# Altium schematic sheet Main.SchDoc: MoonPilot Power - Main
size A3; DrawnBy: Máni Magnússon; Revision: A
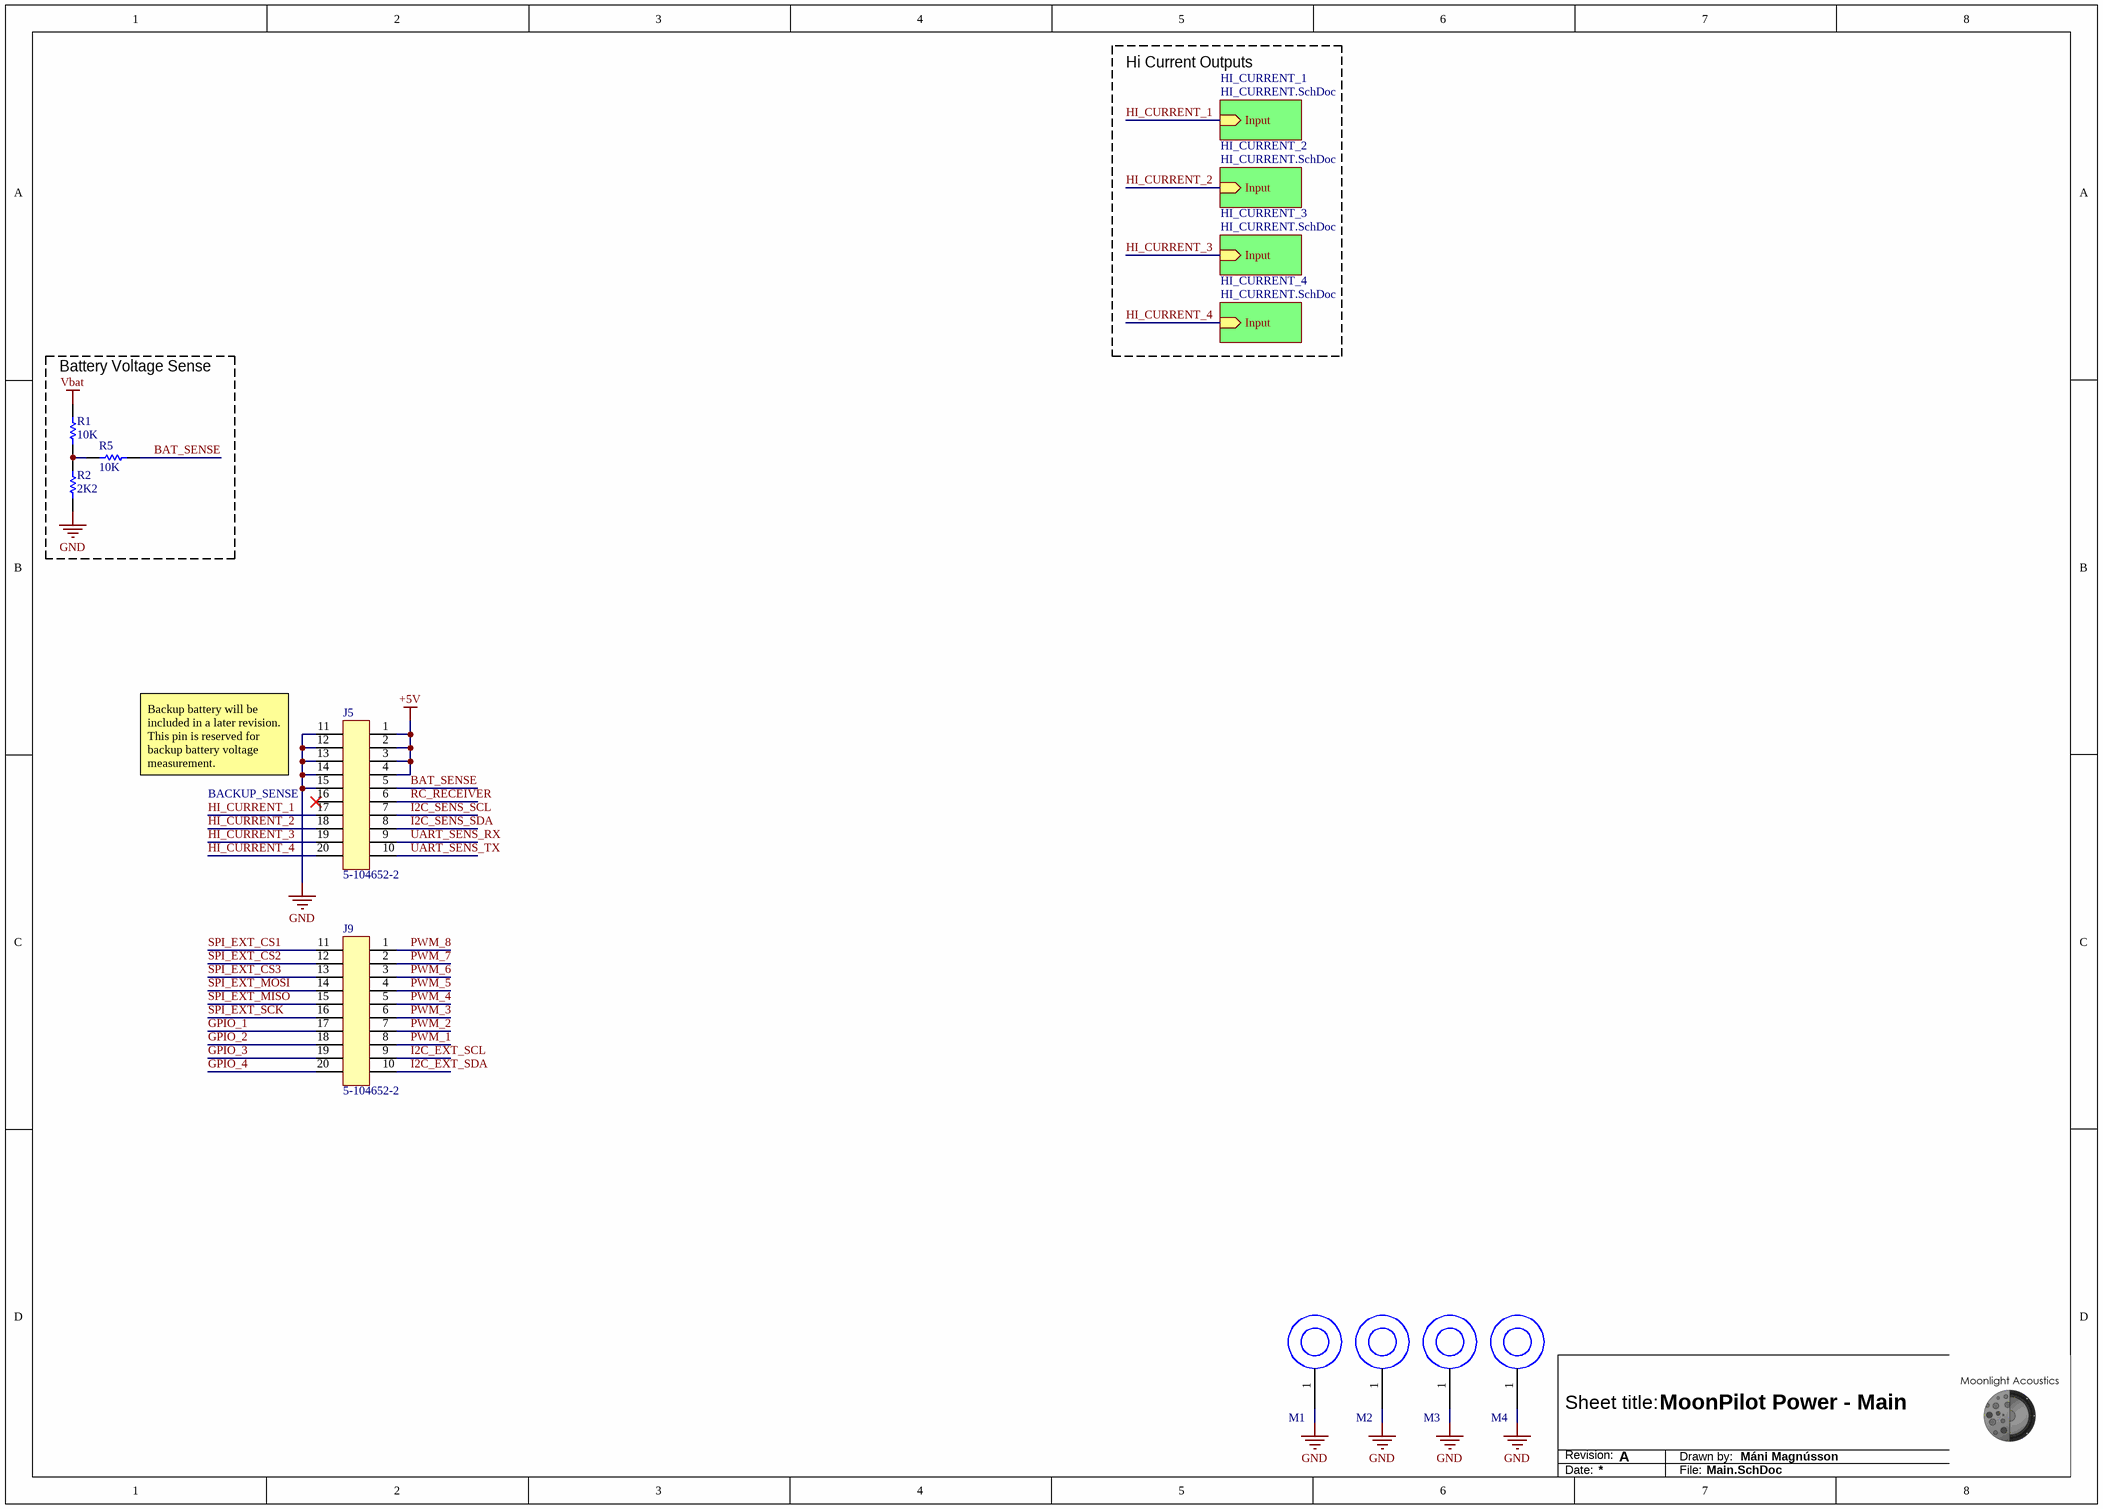
[diagram p0: Main.SchDoc]

## Parts
J5  5-104652-2  [5-104652-2]
J9  5-104652-2  [5-104652-2]
M1  Mounting Screw  [M3_SCREW]  (value not drawn)
M2  Mounting Screw  [M3_SCREW]  (value not drawn)
M3  Mounting Screw  [M3_SCREW]  (value not drawn)
M4  Mounting Screw  [M3_SCREW]  (value not drawn)
R1  10K  [0805_RES]
R2  2K2  [0805_RES]
R5  10K  [0603_RES]

## Blocks framed on the sheet
Battery Voltage Sense: R1 R2 R5

## Sub-sheets
HI_CURRENT_1 = HI_CURRENT.SchDoc: Input (in)
HI_CURRENT_2 = HI_CURRENT.SchDoc: Input (in)
HI_CURRENT_3 = HI_CURRENT.SchDoc: Input (in)
HI_CURRENT_4 = HI_CURRENT.SchDoc: Input (in)

## Nets
+5V: J5.1 J5.2 J5.3 J5.4
GND: J5.11 J5.12 J5.13 J5.14 J5.15 M1.1 M2.1 M3.1 M4.1 R2.2
Vbat: R1.1
BAT_SENSE: J5.5 R5.2
GPIO_1: J9.17
GPIO_2: J9.18
GPIO_3: J9.19
GPIO_4: J9.20
HI_CURRENT_1: J5.17 ; sheet HI_CURRENT_1/Input
HI_CURRENT_2: J5.18 ; sheet HI_CURRENT_2/Input
HI_CURRENT_3: J5.19 ; sheet HI_CURRENT_3/Input
HI_CURRENT_4: J5.20 ; sheet HI_CURRENT_4/Input
I2C_EXT_SCL: J9.9
I2C_EXT_SDA: J9.10
I2C_SENS_SCL: J5.7
I2C_SENS_SDA: J5.8
PWM_1: J9.8
PWM_2: J9.7
PWM_3: J9.6
PWM_4: J9.5
PWM_5: J9.4
PWM_6: J9.3
PWM_7: J9.2
PWM_8: J9.1
RC_RECEIVER: J5.6
SPI_EXT_CS1: J9.11
SPI_EXT_CS2: J9.12
SPI_EXT_CS3: J9.13
SPI_EXT_MISO: J9.15
SPI_EXT_MOSI: J9.14
SPI_EXT_SCK: J9.16
UART_SENS_RX: J5.9
UART_SENS_TX: J5.10
NetR1_2: R1.2 R2.1 R5.1

Not connected (* = marked no-connect by the designer): J5 16(*)*

## Notes on the sheet
- Hi Current Outputs
- Backup battery will be included in a later revision. This pin is reserved for backup battery voltage measurement.
- BACKUP_SENSE
- Sheet title:
- Revision:
- Drawn by:
- Date:
- File:

## Library data of the parts
J5 J9 = 20 pin vertical board to board female: Digikey part no. A33547-ND / 1.27mm female board to board connector, 2 row
M1-M4 = Mounting Screw: M4 and M3 scew holes, just pick the right footprint
R1 R2 R5 = Resistor